# EAGLE schematic 40-auxiliary-backplane-interface (EAGLE 6.6.0)
AUTHOR: Sean Leavey; COMPANY: Institute for Gravitational Research; DATE: 2015-01-19; REVISIONAUTHOR1: Sean Leavey; REVISIONAUTHOR2: Sean Leavey; REVISIONAUTHOR3: Sean Leavey; REVISIONAUTHOR4: Sean Leavey; REVISIONDATE1: 2015-06-30; REVISIONDATE2: 2015-07-14; REVISIONDATE3: 2015-09-19; REVISIONDATE4: 2016-04-06; TITLE: AUX COIL DRIVER; TITLE2: SUBRACK
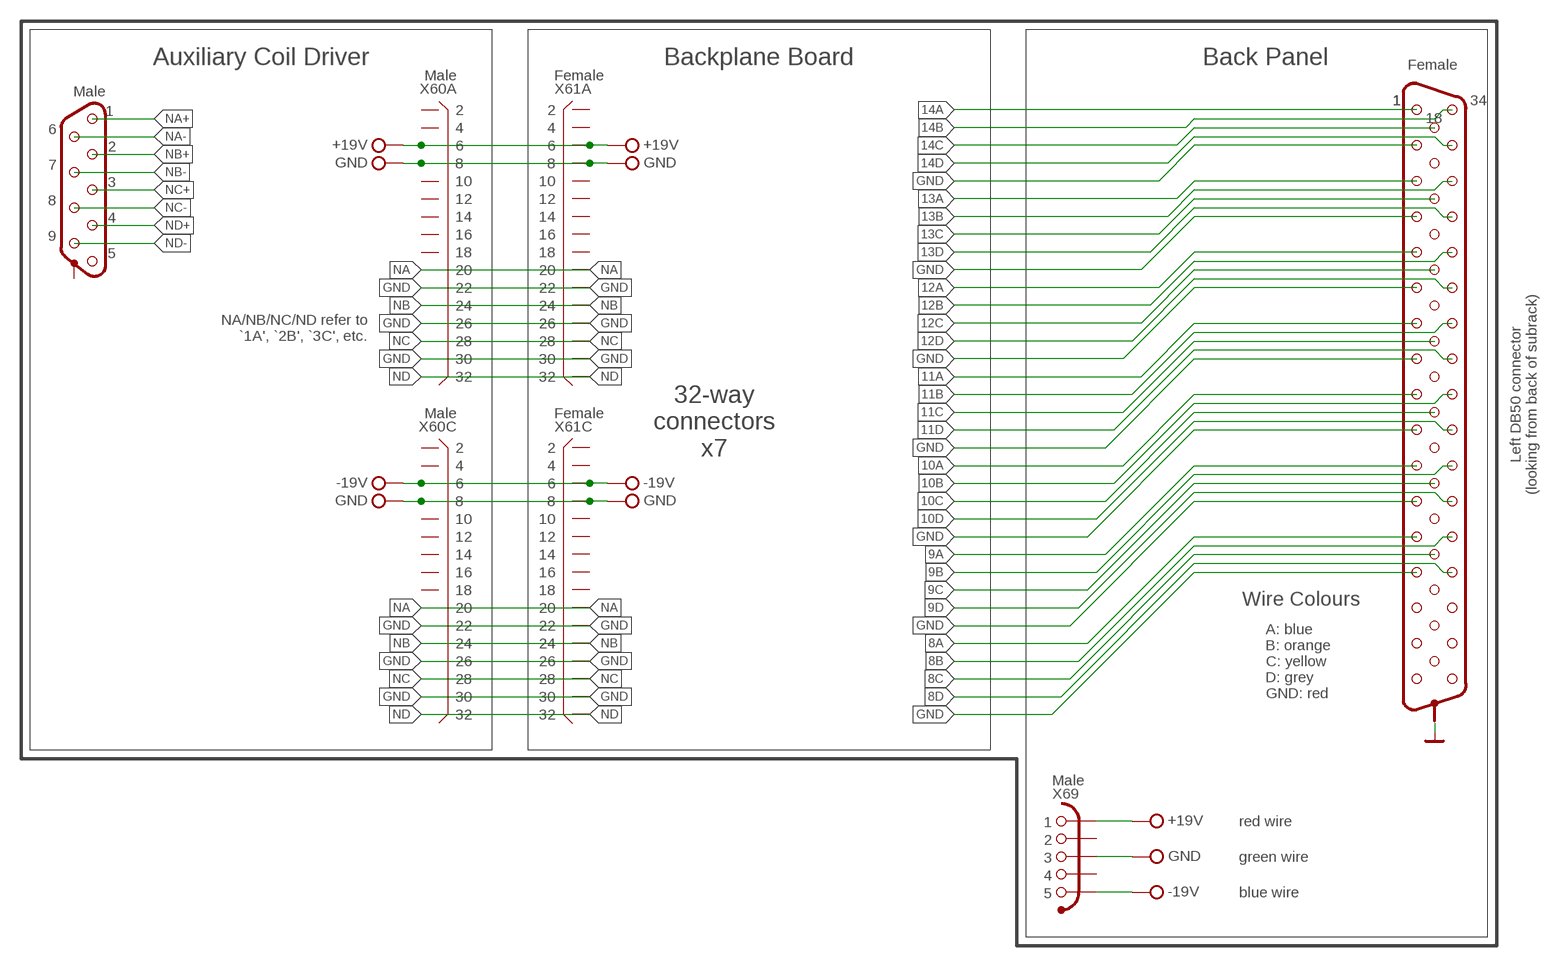
[diagram p0: schematic, sheet 1]

## Parts
G9  VG  [DUMMY1]
U$11  Female  XDSUB50-SHIELD  [DUMMY50]
X59  Male  XDSUB9-SHIELD  [DUMMY10]
X60  Male  XB32-AC  [X32-BACK-AC]
X61  Female  XB32-AC  [X32-BACK-AC]
X69  Male  XS05-LEMO0B-HR  [XS05-LEMO0B-HR]
X70  +19V  XP02  [DUMMY1]
X71  GND  XP02  [DUMMY1]
X72  -19V  XP02  [DUMMY1]
X73  +19V  XP02  [DUMMY1]
X74  GND  XP02  [DUMMY1]
X75  -19V  XP02  [DUMMY1]
X76  GND  XP02  [DUMMY1]
X77  +19V  XP02  [DUMMY1]
X78  GND  XP02  [DUMMY1]
X79  -19V  XP02  [DUMMY1]
X81  GND  XP02  [DUMMY1]

## Nets
8A: U$11.13
8B: U$11.46
8C: U$11.30
8D: U$11.47
9A: U$11.11
9B: U$11.44
9C: U$11.28
9D: U$11.45
10A: U$11.9
10B: U$11.42
10C: U$11.26
10D: U$11.43
11A: U$11.7
11B: U$11.40
11C: U$11.24
11D: U$11.41
12A: U$11.5
12B: U$11.38
12C: U$11.22
12D: U$11.39
13A: U$11.3
13B: U$11.36
13C: U$11.20
13D: U$11.37
14A: U$11.1
14B: U$11.34
14C: U$11.18
14D: U$11.35
GND: U$11.2 U$11.4 U$11.6 U$11.8 U$11.10 U$11.12 U$11.14 X60.A22 X60.A26 X60.A30 X60.C22 X60.C26 X60.C30 X61.A22 X61.A26 X61.A30 X61.C22 X61.C26 X61.C30
N$8: X69.3 X71.1
N$156: X69.1 X70.1
N$159: X69.5 X72.1
N$198: G9.1(N$DUMMY)
N$220: X60.A8 X61.A8 X76.1 X78.1
N$221: X60.A6 X61.A6 X73.1 X77.1
N$222: X60.C8 X61.C8 X74.1 X81.1
N$223: X60.C6 X61.C6 X75.1 X79.1
NA: X60.A20 X60.C20 X61.A20 X61.C20
NA+: X59.1
NA-: X59.6
NB: X60.A24 X60.C24 X61.A24 X61.C24
NB+: X59.2
NB-: X59.7
NC: X60.A28 X60.C28 X61.A28 X61.C28
NC+: X59.3
NC-: X59.8
ND: X60.A32 X60.C32 X61.A32 X61.C32
ND+: X59.4
ND-: X59.9
Unconnected: U$11.15 U$11.16 U$11.17 U$11.19 U$11.21 U$11.23 U$11.25 U$11.27 U$11.29 U$11.31 U$11.32 U$11.33 U$11.48 U$11.49 U$11.50 U$11.51(S) X59.5 X59.10(S) X60.A2 X60.A4 X60.A10 X60.A12 X60.A14 X60.A16 X60.A18 X60.C2 X60.C4 X60.C10 X60.C12 X60.C14 X60.C16 X60.C18 X61.A2 X61.A4 X61.A10 X61.A12 X61.A14 X61.A16 X61.A18 X61.C2 X61.C4 X61.C10 X61.C12 X61.C14 X61.C16 X61.C18 X69.2 X69.4 X69.GND@1(GND) X69.GND@2(GND) X69.GND@3(GND) X69.GND@4(GND)

## Notes on the sheet
- Auxiliary Coil Driver | Backplane Board | Back Panel
- NA/NB/NC/ND refer to
  `1A', `2B', `3C', etc.
- Left DB50 connector
  (looking from back of subrack)
- 32-way
  connectors
  x7
- Wire Colours
- A: blue
  B: orange
  C: yellow
  D: grey
  GND: red
- red wire
- green wire
- blue wire

## Library data of the parts
G9 = symbols:VG: Ground symbol
U$11 = symbols:XDSUB50-SHIELD: D-Sub connector, 50 pins, with shield; SPICE: <ignore>
X59 = symbols:XDSUB9-SHIELD: D-Sub connector, 9 pins, with shield; SPICE: <ignore>
X60 X61 = connectors:XB32-AC: Backplane connector 32 pins Used planes A+C; IGNOREVALUE: 1; SPICE: <ignore>
X69 = connectors:XS05: Shielded connector, 5 pins, 4 shield pins; IGNOREVALUE: 1; SPICE: <ignore>
X70-X79 X81 = symbols:XP02: I/O pin, closed; SPICE: <ignore>